# EAGLE board MOTOR_DRIVER_dupl_everything_mount_holes (EAGLE 8.0.1), part 1 of 2
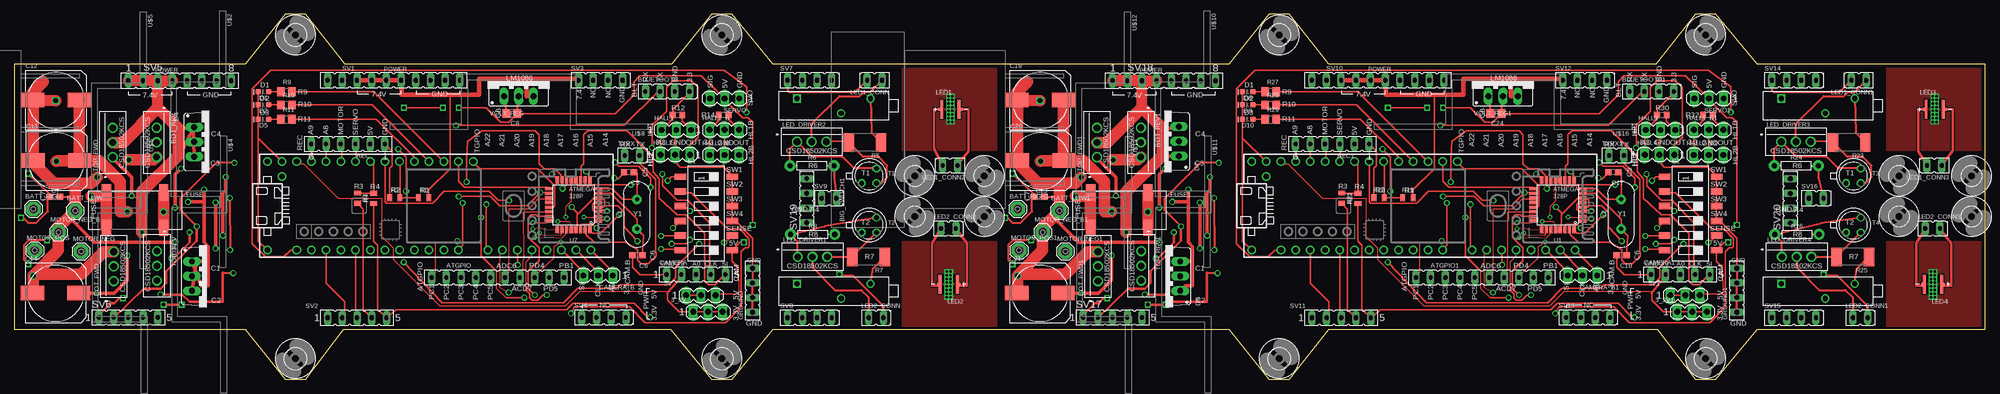
[diagram p8: board, top side]
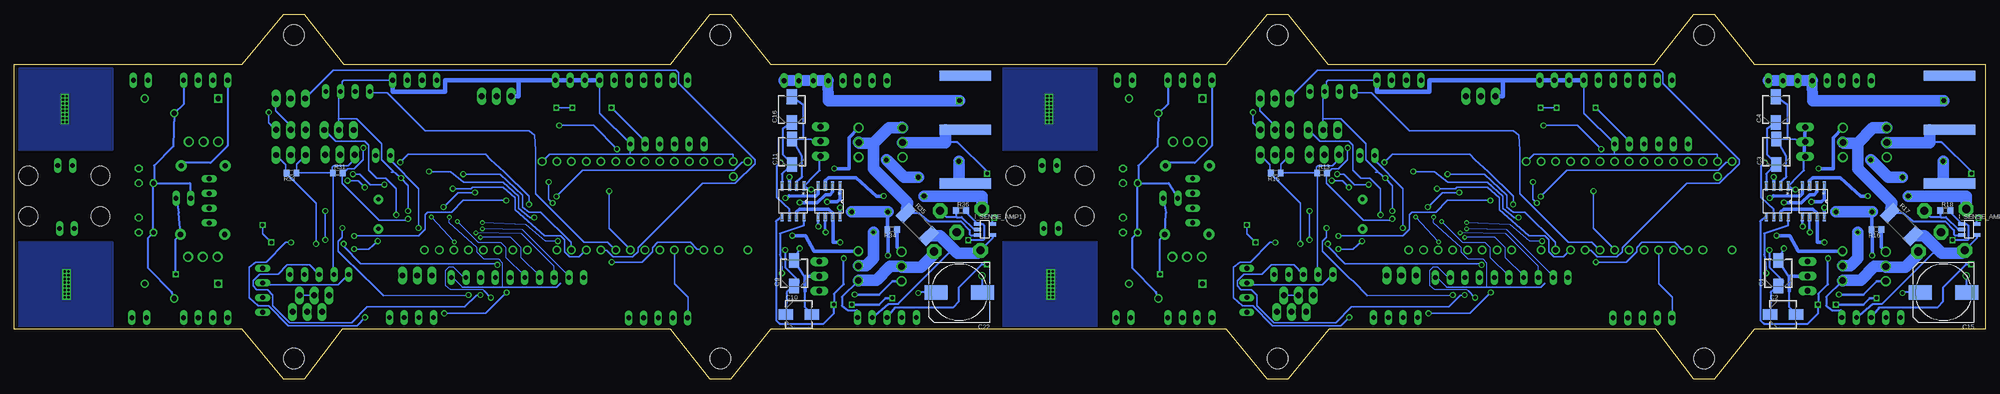
[diagram p9: board, bottom side, seen from below]

Size 340.36 x 62.99 mm. Coordinates in mm from the lower left corner, seen from the top.
Outline: 0,54.36 0,8.64 39.88,8.64 46.74,0 50.29,0 56.9,8.64 113.28,8.64 120.4,0 123.95,0 131.06,8.64 209.8,8.64 216.66,0 220.22,0 227.08,8.64 283.72,8.64 290.32,0 293.88,0 300.99,8.64 340.36,8.64 340.36,54.36 300.99,54.36 293.88,62.99 290.32,62.99 283.46,54.36 227.08,54.36 220.22,62.99 216.66,62.99 209.8,54.36 131.06,54.36 123.95,62.99 120.4,62.99 113.54,54.36 57.15,54.36 50.29,62.99 46.74,62.99 39.88,54.36 0,54.36
Copper layers (1*16): Top 0.035559375mm / dielectric 1.501140625mm / Bottom 0.035559375mm
Design rules "typical_4pcb *": minimum track width 6mil, minimum drill 15mil, track to track 8mil, track to pad 8mil, pad to pad 8mil, via to via 8mil, smd to smd 6mil, copper to edge 15mil, drill to drill 8mil, minimum pad ring 10mil, minimum via ring 8mil, stop-mask expansion 4mil, vias tented up to drill 0mil, thermal gap 10mil
Net classes: 0 default: width 0.152 mm, drill 0.381 mm, clearance 0.152 mm

## Footprints (pad centres in the part's own frame; a part is rotated, then mirrored left to right if it is on the bottom)
MA03-1 = drill 1.016 long: 1 -2.54,0; 2 0,0; 3 2.54,0
FE10 = drill 0.813 long: 1 -11.43,0; 2 -8.89,0; 3 -6.35,0; 4 -3.81,0; 5 -1.27,0; 6 1.27,0; 7 3.81,0; 8 6.35,0; 9 8.89,0; 10 11.43,0
SE14 = drill 1.397 pad 2.54 octagon: MP 0,0
BIGSWITCH = smd 1.778 x 8.89 bottom: GND 4.65,0; NC 13.97,0; VCC -4.65,0
FE04-1 = drill 0.813 long: 1 -5.08,0; 2 -2.54,0; 3 0,0; 4 2.54,0
KCS3 = drill 1.143 pad 1.651: 1 -5.08,0; 2 -2.54,0; 3 0,0
CAP_EEE_B = smd 2.515 x 1.778: 1 -2.21,0; 2 2.21,0
C0603 = smd 1.1 x 1: 1 -0.85,0; 2 0.85,0
C0805 = smd 1.3 x 1.5: 1 -0.95,0; 2 0.95,0
153CLV-1010 = smd 4 x 2.5: + 4,0; - -4,0
FE05-1 = drill 0.813 long: 1 -5.08,0; 2 -2.54,0; 3 0,0; 4 2.54,0; 5 5.08,0
LED-0603 = smd 1 x 1: A -0.877,0; C 0.877,0
TO220ABS = drill 1.016 long: A1 -2.54,-2.54; A2 2.54,-2.54; C 0,-2.54
FUSEHOLDER3588 = smd 1.57 x 2.82: A -4.96,3.03; B 4.96,3.03; C -4.96,-3.03; D 4.96,-3.03
SOIC-8_M = smd 1.6 x 0.533: 1 -2.654,1.905; 2 -2.654,0.635; 3 -2.654,-0.635; 4 -2.654,-1.905; 5 2.654,-1.905; 6 2.654,-0.635; 7 2.654,0.635; 8 2.654,1.905
3,6 = hole 3.6: 0,0
3,3 = hole 3.3: 0,0
SOT23-5 = smd 0.6 x 1.2: 1 -0.95,-1.306; 2 0,-1.306; 3 0.95,-1.306; 4 0.95,1.306; 5 -0.95,1.306
XP = smd 0.5 x 3.3: NEGATIVE 1.5,0; POSITIVE -1.5,0 | smd 0.4 x 0.5: NEGATIVE1 1.85,0; POSITIVE1 -1.85,0 | smd 1.3 x 3.3: THERMAL 0,0
FE02-1 = drill 0.813 long: 1 -5.08,0; 2 -2.54,0
0805 = smd 0.8 x 1.2: 1 -0.9,0; 2 0.9,0
R2512 = smd 1.8 x 3.2: 1 -2.8,0; 2 2.8,0
AXIAL-0.3 = drill 0.9 pad 1.88: P$1 -3.81,0; P$2 3.81,0
R0805 = smd 1.3 x 1.5: 1 -0.95,0; 2 0.95,0
R0603 = smd 1 x 1.1: 1 -0.85,0; 2 0.85,0
FE06 = drill 0.813 long: 1 -6.35,0; 2 -3.81,0; 3 -1.27,0; 4 1.27,0; 5 3.81,0; 6 6.35,0
SMS-006 = smd 1.092 x 2.007: 1 -6.35,-4.496; 2 -3.81,-4.496; 3 -1.27,-4.496; 4 1.27,-4.496; 5 3.81,-4.496; 6 6.35,-4.496; 7 6.35,4.496; 8 3.81,4.496; 9 1.27,4.496; 10 -1.27,4.496; 11 -3.81,4.496; 12 -6.35,4.496
FE08 = drill 0.813 long: 1 -8.89,0; 2 -6.35,0; 3 -3.81,0; 4 -1.27,0; 5 1.27,0; 6 3.81,0; 7 6.35,0; 8 8.89,0
TO18 = drill 0.813 octagon: 1 -1.27,-1.27; 2 1.27,-1.27; 3 1.27,1.27
TQFP32-08 = smd 1.27 x 0.559: 1 -4.293,2.8; 2 -4.293,2; 3 -4.293,1.2; 4 -4.293,0.4; 5 -4.293,-0.4; 6 -4.293,-1.2; 7 -4.293,-2; 8 -4.293,-2.8; 17 4.293,-2.8; 18 4.293,-2; 19 4.293,-1.2; 20 4.293,-0.4; 21 4.293,0.4; 22 4.293,1.2; 23 4.293,2; 24 4.293,2.8 | smd 0.559 x 1.27: 9 -2.8,-4.293; 10 -2,-4.293; 11 -1.2,-4.293; 12 -0.4,-4.293; 13 0.4,-4.293; 14 1.2,-4.293; 15 2,-4.293; 16 2.8,-4.293; 25 2.8,4.293; 26 2,4.293; 27 1.2,4.293; 28 0.4,4.293; 29 -0.4,4.293; 30 -1.2,4.293; 31 -2,4.293; 32 -2.8,4.293
TEENSY_3.5/3.6_BASIC_FEWER_PIN = drill 0.965: 1/TX -22.86,-7.62; 2 -20.32,-7.62; 3/CANTX -17.78,-7.62; 3V3_LO -22.86,7.62; 4/CANRX -15.24,-7.62; 5 -12.7,-7.62; 6 -10.16,-7.62; 7 -7.62,-7.62; 8 -5.08,-7.62; 9/CS -2.54,-7.62; 10/CS 0,-7.62; 11/MOSI 2.54,-7.62; 12/MISO 5.08,-7.62; 13/SCK 5.08,7.62; 14/A0 2.54,7.62; 15/A1 0,7.62; 16/A2 -2.54,7.62; 17/A3 -5.08,7.62; 18/A4/SDA -7.62,7.62; 19/A5/SCL -10.16,7.62; 20/A6 -12.7,7.62; 21/A7 -15.24,7.62; 22/A8 -17.78,7.62; 23/A9 -20.32,7.62; 24 10.16,-7.62; 25 12.7,-7.62; 26 15.24,-7.62; 27 17.78,-7.62; 28 20.32,-7.62; 29 22.86,-7.62; 30 25.4,-7.62; 31/A12 27.94,-7.62; AGND -25.4,7.62; GND -27.94,-7.62; GND2 7.62,7.62; VIN -27.94,7.62; VUSB -25.4,5.08
POT = drill 0.9 square: P1 1.145,3.175 | drill 0.9: P2 3.685,10.795; P3 1.145,15.875
TO220S = drill 1.016 long: 1 -2.54,-2.54; 2 0,-2.54; 3 2.54,-2.54
HC49US = drill 0.7 pad 1.651: 1 -2.54,0; 2 2.54,0

## Placement (x,y rotation side)
3_3V  [MA03-1]  119.79,11.64 0 top
3_3V1  [MA03-1]  289.79,11.64 0 top
5V  [MA03-1]  118.57,14.48 0 top
5V1  [MA03-1]  288.57,14.48 0 top
ATGPIO  [FE10]  83.49,17.59 0 top
ATGPIO1  [FE10]  253.49,17.59 0 top
BATT_HIGH  SE14  [SE14]  3.27,29.4 0 top
BATT_HIGH1  SE14  [SE14]  173.27,29.4 0 top
BATT_LOW  SE14  [SE14]  10.47,29.1 0 top
BATT_LOW1  SE14  [SE14]  180.47,29.1 0 top
BIG_SWITCH  [BIGSWITCH]  6.16,38.45 90 top
BIG_SWITCH1  [BIGSWITCH]  176.16,38.45 90 top
BLUETOOTH  [FE04-1]  114.05,49.7 0 top
BLUETOOTH1  [FE04-1]  284.05,49.7 0 top
BOT_FWD  CSD18502KCS_KCS_3  [KCS3]  17.14,22.03 90 top
BOT_FWD1  CSD18502KCS_KCS_3  [KCS3]  187.14,22.03 90 top
BOT_REV  CSD18502KCS_KCS_3  [KCS3]  24.54,38.36 270 top
BOT_REV1  CSD18502KCS_KCS_3  [KCS3]  194.54,38.36 270 top
C1  10uF  [CAP_EEE_B]  35.71,18.31 90 bottom
C2  10uF  [CAP_EEE_B]  34.89,11.18 0 bottom
C3  10uF  [CAP_EEE_B]  36.05,39.29 90 bottom
C4  10uF  [CAP_EEE_B]  36.12,46.58 90 bottom
C5  18 pF  [C0603]  106.14,35.75 180 top
C6  18 pF  [C0603]  107.58,21.41 180 top
C7  [C0603]  7,31.51 0 top
C8  10u  [C0805]  85.88,45.89 180 top
C9  10uF  [CAP_EEE_B]  205.71,18.31 90 bottom
C10  10uF  [CAP_EEE_B]  204.89,11.18 0 bottom
C11  10uF  [CAP_EEE_B]  206.05,39.29 90 bottom
C12  33u  [153CLV-1010]  7.17,48.19 0 top
C13  33u  [153CLV-1010]  7.26,37.75 0 top
C14  33u  [153CLV-1010]  7.12,14.89 0 top
C15  33u  [153CLV-1010]  7.17,14.99 180 bottom
C16  10uF  [CAP_EEE_B]  206.12,46.58 90 bottom
C17  18 pF  [C0603]  276.14,35.75 180 top
C18  18 pF  [C0603]  277.58,21.41 180 top
C19  33u  [153CLV-1010]  177.17,48.19 0 top
C20  33u  [153CLV-1010]  177.26,37.75 0 top
C21  33u  [153CLV-1010]  177.12,14.89 0 top
C22  33u  [153CLV-1010]  177.17,14.99 180 bottom
C23  [C0603]  177,31.51 0 top
C24  10u  [C0805]  255.88,45.89 180 top
CAMERA  [FE05-1]  117.72,18.09 0 top
CAMERA1  [FE05-1]  287.72,18.09 0 top
CAMERA_B  [MA03-1]  100.81,17.92 180 top
CAMERA_B1  [MA03-1]  270.81,17.92 180 top
D1  [LED-0603]  43,49.64 180 top
D2  [LED-0603]  43,47.39 180 top
D3  BYV32  [TO220ABS]  33.2,17.79 270 top
D4  BYV32  [TO220ABS]  33.6,41 270 top
D5  [LED-0603]  43,44.89 180 top
D6  BYV32  [TO220ABS]  198.8,17.79 90 top
D7  BYV32  [TO220ABS]  198.6,41.08 90 top
D8  [LED-0603]  213,49.64 180 top
D9  [LED-0603]  213,47.39 180 top
D10  [LED-0603]  213,44.89 180 top
FUSE  [FUSEHOLDER3588]  20.85,29.2 0 top
FUSE1  [FUSEHOLDER3588]  190.85,29.2 0 top
GATE1  MIC4604YM  [SOIC-8_M]  29.68,30.72 270 bottom
GATE2  MIC4604YM  [SOIC-8_M]  35.88,30.72 270 bottom
GATE3  MIC4604YM  [SOIC-8_M]  199.68,30.72 270 bottom
GATE4  MIC4604YM  [SOIC-8_M]  205.88,30.72 270 bottom
GROUND  [FE04-1]  127.5,16.64 90 top
GROUND1  [FE04-1]  297.5,16.64 90 top
H1  MOUNT-HOLE3.6  [3,6]  48.51,3.56 0 top
H2  MOUNT-HOLE3.6  [3,6]  122.17,3.56 0 top
H3  MOUNT-HOLE3.6  [3,6]  48.51,59.44 0 top
H4  MOUNT-HOLE3.6  [3,6]  122.17,59.44 0 top
H5  MOUNT-HOLE3.6  [3,6]  218.44,59.44 0 top
H6  MOUNT-HOLE3.6  [3,6]  292.1,59.44 0 top
H7  MOUNT-HOLE3.6  [3,6]  218.44,3.56 0 top
H8  MOUNT-HOLE3.6  [3,6]  292.1,3.56 0 top
H9  MOUNT-HOLE3.3  [3,3]  155.5,35.14 90 top
H10  MOUNT-HOLE3.3  [3,3]  167.5,35.14 90 top
H11  MOUNT-HOLE3.3  [3,3]  155.5,28.14 90 top
H12  MOUNT-HOLE3.3  [3,3]  167.5,28.14 90 top
H13  MOUNT-HOLE3.3  [3,3]  325.5,35.14 90 top
H14  MOUNT-HOLE3.3  [3,3]  325.5,28.14 90 top
H15  MOUNT-HOLE3.3  [3,3]  338,28.14 90 top
H16  MOUNT-HOLE3.3  [3,3]  338,35.14 90 top
HALL1  [MA03-1]  114.33,43.04 0 top
HALL1_B  [MA03-1]  122.63,43.06 0 top
HALL1_B1  [MA03-1]  292.63,43.06 0 top
HALL2  [MA03-1]  114.13,38.8 0 top
HALL2_B  [MA03-1]  122.63,38.72 0 top
HALL2_B1  [MA03-1]  292.63,38.72 0 top
HALL3  [MA03-1]  284.33,43.04 0 top
HALL4  [MA03-1]  284.13,38.8 0 top
I_SENSE_AMP  INA138  [SOT23-5]  2.75,25.89 270 bottom
I_SENSE_AMP1  INA138  [SOT23-5]  172.75,25.89 270 bottom
LED1  CREE_XP  [XP]  161.67,46.62 0 top
LED1_CONN  [FE02-1]  144.75,51.64 180 top
LED1_CONN1  [FE02-1]  314.75,51.64 180 top
LED1_CONN2  [FE02-1]  157.8,36.92 180 top
LED1_CONN3  [FE02-1]  327.8,36.92 180 top
LED2  CREE_XP  [XP]  161.38,16.39 180 top
LED2_CONN  [FE02-1]  152.62,10.64 0 top
LED2_CONN1  [FE02-1]  322.62,10.64 0 top
LED2_CONN2  [FE02-1]  165.12,26.01 0 top
LED2_CONN3  [FE02-1]  335.12,26.01 0 top
LED3  CREE_XP  [XP]  331.67,46.62 0 top
LED4  CREE_XP  [XP]  331.38,16.39 180 top
LED_DRIVER1  CSD18502KCS_KCS_3  [KCS3]  140.38,21.14 0 top
LED_DRIVER2  CSD18502KCS_KCS_3  [KCS3]  140.25,41.01 0 top
LED_DRIVER3  CSD18502KCS_KCS_3  [KCS3]  310.25,41.01 0 top
LED_DRIVER4  CSD18502KCS_KCS_3  [KCS3]  310.38,21.14 0 top
MOTOR_NEG  SE14  [SE14]  11.51,22.07 0 top
MOTOR_NEG1  SE14  [SE14]  181.51,22.07 0 top
MOTOR_NEG_B  SE14  [SE14]  7.6,25.39 0 top
MOTOR_NEG_B1  SE14  [SE14]  177.6,25.39 0 top
MOTOR_POS  SE14  [SE14]  3.51,22.25 0 top
MOTOR_POS1  SE14  [SE14]  173.51,22.25 0 top
R1  2.8K  [0805]  70.66,31.38 0 top
R2  1.62K  [0805]  65.7,31.38 0 top
R3  2.32K  [0805]  59.24,31.29 270 top
R4  1.15K  [0805]  62.01,31.23 90 top
R5  1  [R2512]  146.88,40.89 180 top
R6  1k  [AXIAL-0.3]  137.75,36.89 0 top
R7  1  [R2512]  147.5,21.14 180 top
R8  1k  [AXIAL-0.3]  137.88,25.01 0 top
R9  59  [R0805]  47,49.64 0 top
R10  59  [R0805]  47,47.39 0 top
R11  59  [R0805]  47,44.89 0 top
R12  10k  [R0603]  114.5,45.64 0 top
R13  10k  [R0603]  114.5,35.64 0 bottom
R14  10k  [R0603]  122.5,45.64 0 top
R15  10k  [R0603]  122.5,35.64 180 bottom
R16  10k  [R0603]  18.75,25.89 180 bottom
R17  20m  [R2512]  14.39,26.75 315 bottom
R18  100k  [R0603]  6.88,29.14 0 bottom
R19  2.8K  [0805]  240.66,31.38 0 top
R20  1.62K  [0805]  235.7,31.38 0 top
R21  2.32K  [0805]  229.24,31.29 270 top
R22  1.15K  [0805]  232.01,31.23 90 top
R23  1  [R2512]  316.88,40.89 180 top
R24  1k  [AXIAL-0.3]  307.75,36.89 0 top
R25  1  [R2512]  317.5,21.14 180 top
R26  1k  [AXIAL-0.3]  307.88,25.01 0 top
R27  59  [R0805]  217,49.64 0 top
R28  59  [R0805]  217,47.39 0 top
R29  59  [R0805]  217,44.89 0 top
R30  10k  [R0603]  284.5,45.64 0 top
R31  10k  [R0603]  284.5,35.64 0 bottom
R32  10k  [R0603]  292.5,45.64 0 top
R33  10k  [R0603]  292.5,35.64 180 bottom
R34  10k  [R0603]  188.75,25.89 180 bottom
R35  20m  [R2512]  184.39,26.75 315 bottom
R36  100k  [R0603]  176.88,29.14 0 bottom
REC  [FE06]  57.62,40.64 180 top
REC1  [FE06]  227.62,40.64 180 top
S1  SWS006  [SMS-006]  119.48,28.63 270 top
S2  SWS006  [SMS-006]  289.48,28.63 270 top
SERVO  [MA03-1]  122.66,48.49 180 top
SERVO1  [MA03-1]  292.66,48.49 180 top
SV1  [FE10]  65.5,51.64 0 top
SV2  [FE05-1]  59.17,10.61 0 top
SV3  [FE04-1]  102.5,51.64 0 top
SV4  [FE04-1]  103.06,10.69 0 top
SV5  [FE08]  28.55,51.56 0 top
SV6  [FE05-1]  19.66,10.64 0 top
SV7  [FE04-1]  138.62,51.64 0 top
SV8  [FE04-1]  138.62,10.64 0 top
SV9  [FE02-1]  144.5,31.26 0 top
SV10  [FE10]  235.5,51.64 0 top
SV11  [FE05-1]  229.17,10.61 0 top
SV12  [FE04-1]  272.5,51.64 0 top
SV13  [FE04-1]  273.06,10.69 0 top
SV14  [FE04-1]  308.62,51.64 0 top
SV15  [FE04-1]  308.62,10.64 0 top
SV16  [FE02-1]  315,31.26 0 top
SV17  [FE05-1]  189.66,10.64 0 top
SV18  [FE08]  198.55,51.56 0 top
SV19  [FE04-1]  136.85,32.11 90 top
SV20  [FE04-1]  306.73,32.08 90 top
T1  2N2222  [TO18]  147.62,35.14 0 top
T2  2N2222  [TO18]  147.62,26.64 0 top
T3  2N2222  [TO18]  317.62,35.14 0 top
T4  2N2222  [TO18]  317.62,26.64 0 top
TOP_FWD  CSD18502KCS_KCS_3  [KCS3]  16.97,43.42 90 top
TOP_FWD1  CSD18502KCS_KCS_3  [KCS3]  186.97,43.42 90 top
TOP_REV  CSD18502KCS_KCS_3  [KCS3]  24.61,17.05 270 top
TOP_REV1  CSD18502KCS_KCS_3  [KCS3]  194.61,17.05 270 top
TXRX  [FE02-1]  110.5,38.64 0 top
TXRX1  [FE02-1]  280.5,38.64 0 top
U1  ATMEGA328P_TQFP  [TQFP32-08]  266.58,30.12 180 top
U7  ATMEGA328P_TQFP  [TQFP32-08]  96.58,30.12 180 top
U$1  TEENSY_3.5/3.6_FEWER  [TEENSY_3.5/3.6_BASIC_FEWER_PIN]  71.6,29.95 0 top
U$2  HEATSINK  [HEATSINK]  26.95,41.44 270 top
U$3  POT  [POT]  132,17.64 270 top
U$4  HEATSINK  [HEATSINK]  27.12,19.79 270 top
U$5  HEATSINK  [HEATSINK]  13.25,41.27 270 top
U$6  HEATSINK  [HEATSINK]  13.39,19.75 270 top
U$7  POT  [POT]  132,49.64 270 top
U$8  [HEATSINK]  87.12,52.64 180 top
U$9  TEENSY_3.5/3.6_FEWER  [TEENSY_3.5/3.6_BASIC_FEWER_PIN]  241.6,29.95 0 top
U$10  HEATSINK  [HEATSINK]  196.95,41.44 270 top
U$11  HEATSINK  [HEATSINK]  197.12,19.79 270 top
U$12  HEATSINK  [HEATSINK]  183.25,41.27 270 top
U$13  HEATSINK  [HEATSINK]  183.39,19.75 270 top
U$14  POT  [POT]  302,49.64 270 top
U$15  POT  [POT]  302,17.64 270 top
U$16  [HEATSINK]  257.12,52.64 180 top
VOLT_REG  LM1086TO220V  [TO220S]  87.1,51.42 0 top
VOLT_REG1  LM1086TO220V  [TO220S]  257.1,51.42 0 top
Y1  16MHz  [HC49US]  107.5,28.51 90 top
Y2  16MHz  [HC49US]  277.5,28.51 90 top